# EAGLE design labwiz-module_pH-0.2 (EAGLE 6.5.0)

## Sheet 1 of 2
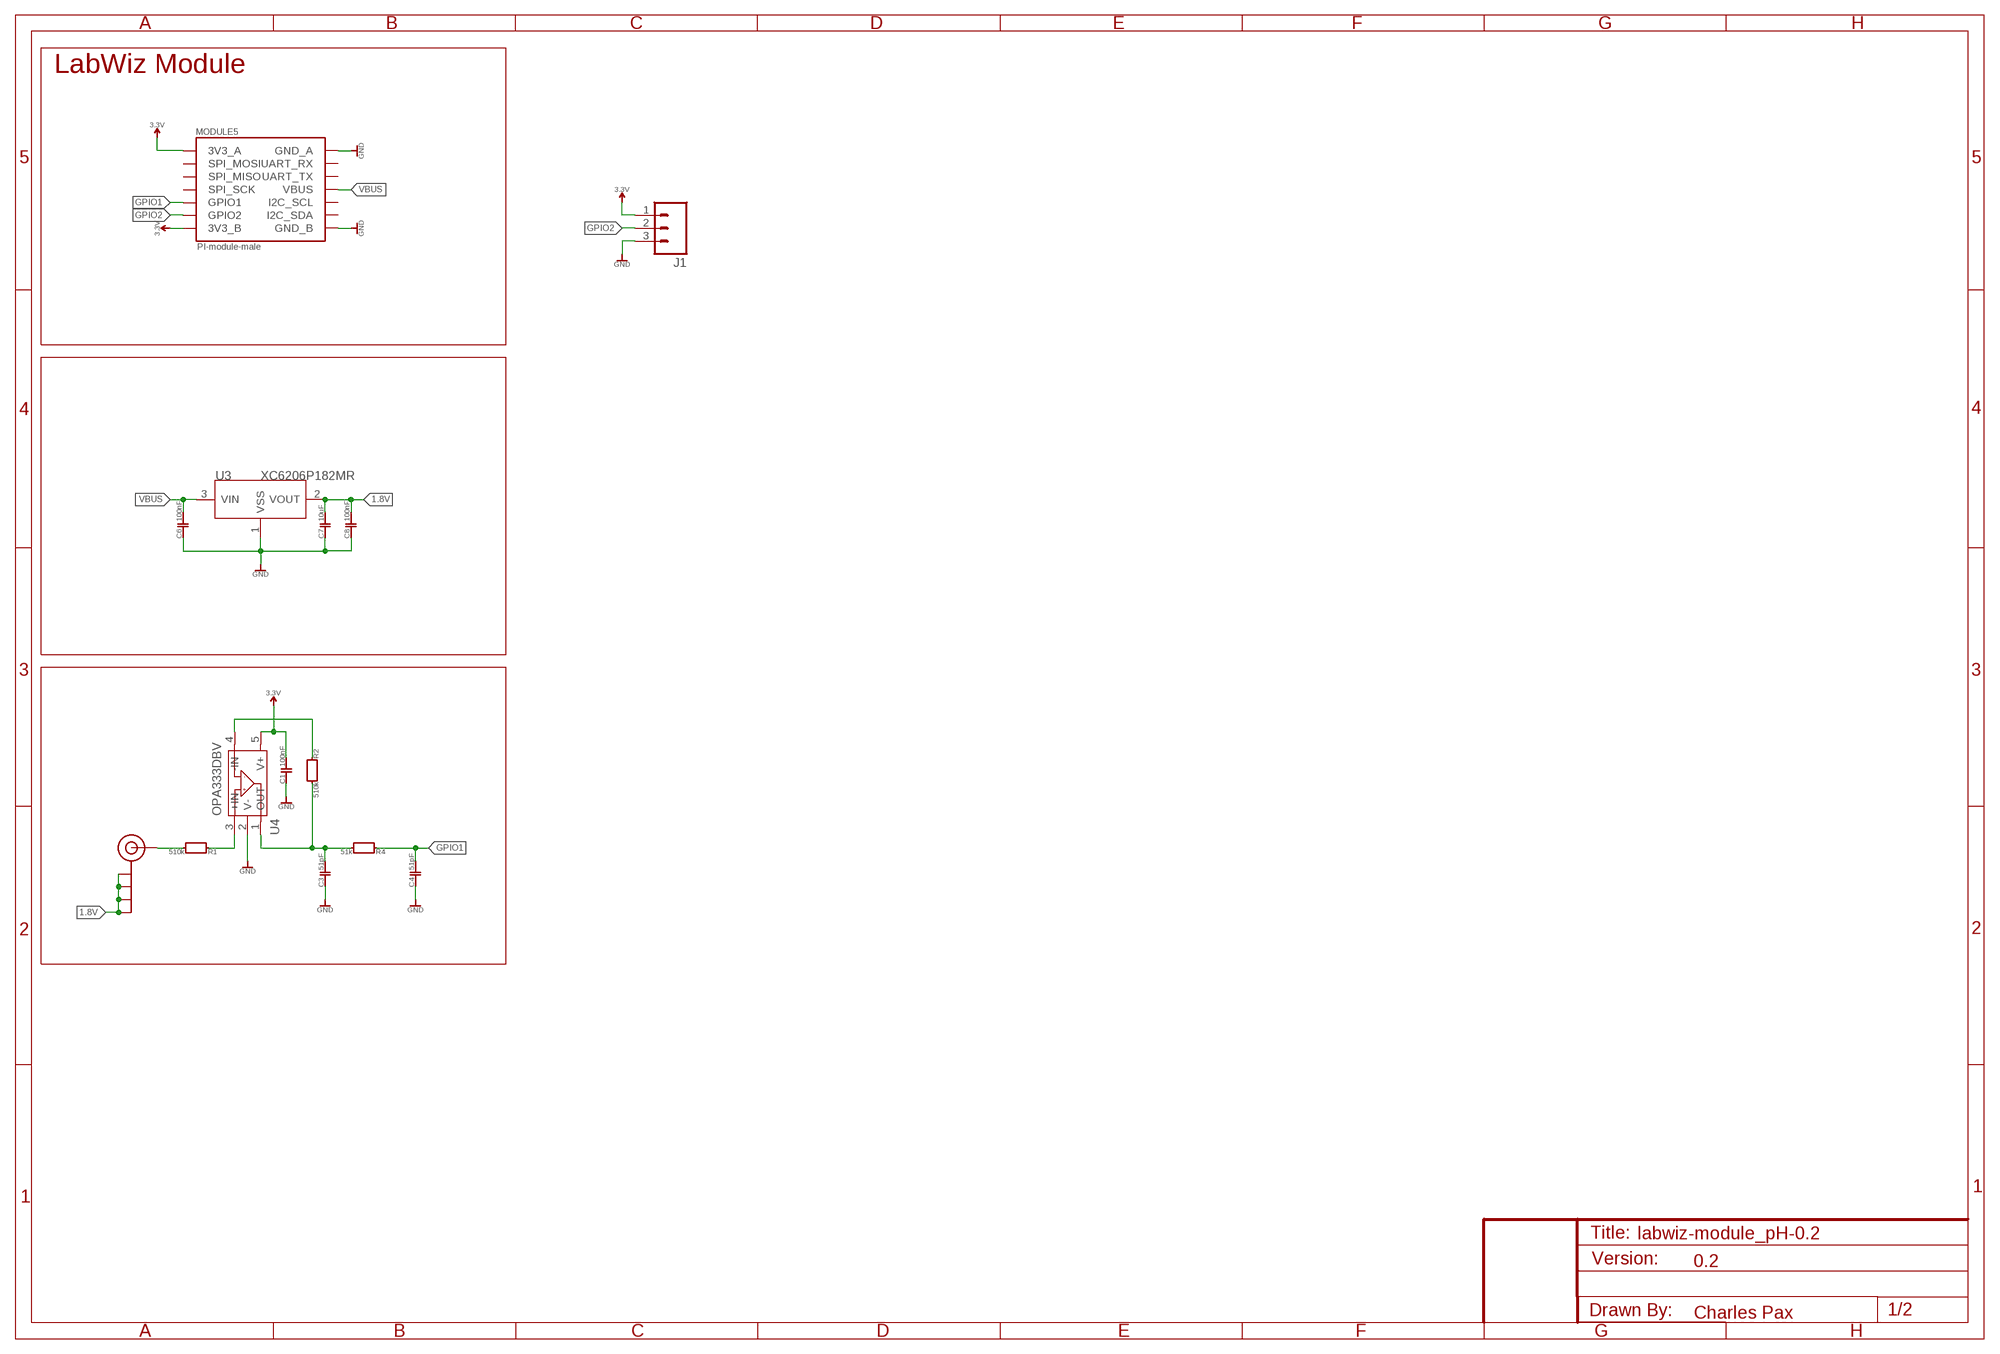
[diagram p0: schematic, sheet 1]

### Parts
C1  100nF  CAPACITOR_FIXED_100NF_0603  [0603]
C3  51pF  CAPACITOR_FIXED_0603  [0603]
C4  51pF  CAPACITOR_FIXED_0603  [0603]
C6  100nF  CAPACITOR_FIXED_100NF_0603  [0603]
C7  10uF  CAPACITOR_FIXED_10UF_0603  [0603]
C8  100nF  CAPACITOR_FIXED_100NF_0603  [0603]
J1  M03LOCK_LONGPADS  [1X03_LOCK_LONGPADS]
J$1  SMA_EDGE  [SMA-EDGE]
MODULE5  PI-module-male  PAX_MODULE_EDGE_MALE_MODULE  [M07X2_2MM_EDGE]
R1  510k  RESISTOR_FIXED_0603  [0603]
R2  510k  RESISTOR_FIXED_0603  [0603]
R4  51k  RESISTOR_FIXED_0603  [0603]
U3  XC6206P182MR  XC6206MR  [SOT23]
U4  OPA333DBV  [SOT23-5]

### Nets
1.8V: C7.2 C8.2 J$1.GND@0(GND) J$1.GND@1(GND) J$1.GND@2(GND) J$1.GND@3(GND) U3.2(VOUT)
3.3V: C1.2 J1.1 MODULE5.P$1(3V3_B) MODULE5.P$13(3V3_A) U4.5(V+)
GND: C1.1 C3.1 C4.1 C6.1 C7.1 C8.1 J1.3 MODULE5.P$2(GND_B) MODULE5.P$14(GND_A) U3.1(VSS) U4.2(V-)
GPIO1: C4.2 MODULE5.P$5(GPIO1) R4.2
GPIO2: J1.2 MODULE5.P$3(GPIO2)
N$4: J$1.SIG(SIGNAL) R1.1
N$12: R1.2 U4.3(+IN)
N$26: R2.2 U4.4(-IN)
N$37: C3.2 R2.1 R4.1 U4.1(OUT)
VBUS: C6.2 MODULE5.P$8(VBUS) U3.3(VIN)
Unconnected: MODULE5.P$4(I2C_SDA) MODULE5.P$6(I2C_SCL) MODULE5.P$7(SPI_SCK) MODULE5.P$9(SPI_MISO) MODULE5.P$10(UART_TX) MODULE5.P$11(SPI_MOSI) MODULE5.P$12(UART_RX)

### Notes on the sheet
- LabWiz Module
- 0.2
- Charles Pax

## Sheet 2 of 2

## Library data of the parts
C1 C3 C4 C6-C8 = PaxInstruments-RCL:CAPACITOR_FIXED: Capacitor
J1 = SparkFun-Connectors:M03: Header 3 Standard 3-pin 0.1" header. Use with straight break away headers (SKU : PRT-00116), right angle break away headers (PRT-00553), swiss pins (PRT-00743), machine pins (PRT-00117), and female headers (PRT-00115). Molex polarized connector foot print use with SKU : PRT-08232 with associated crimp pins and housings.
J$1 = SparkFun-Connectors:SMA_EDGE: SMA Antenna Connector End launch SMA connector. The paste layer has been removed so that the connector can be hand soldered onto the board after reflow.
MODULE5 = PaxInstruments-Connectors:PAX_MODULE; MF: Pax Instruments; MPN: PIxxxx
R1 R2 R4 = PaxInstruments-RCL:RESISTOR_FIXED: Resistor
U3 = IC:XC6206: LOW ESR Cap.Compatible Positive Voltage Regulators
U4 = IC:OPA333: 1.8V,Micro power CMOS oprational amplifiers Zero-Drift Series http://www.ti.com.cn/cn/lit/ds/symlink/opa333.pdf

## Net classes
0 Digital signal: width 0.1 mm, drill 0.2 mm, clearance 0.15 mm
1 3.3V power: width 0.1 mm, drill 0.2 mm, clearance 0.15 mm
2 RTC battery: width 0.1 mm, drill 0.2 mm, clearance 0.15 mm
3 5V power: width 0.1 mm, drill 0.2 mm, clearance 0.15 mm
4 Analog signal: width 0.1 mm, drill 0.2 mm, clearance 0.15 mm
5 GND: width 0.1 mm, drill 0.2 mm, clearance 0.15 mm

## Board
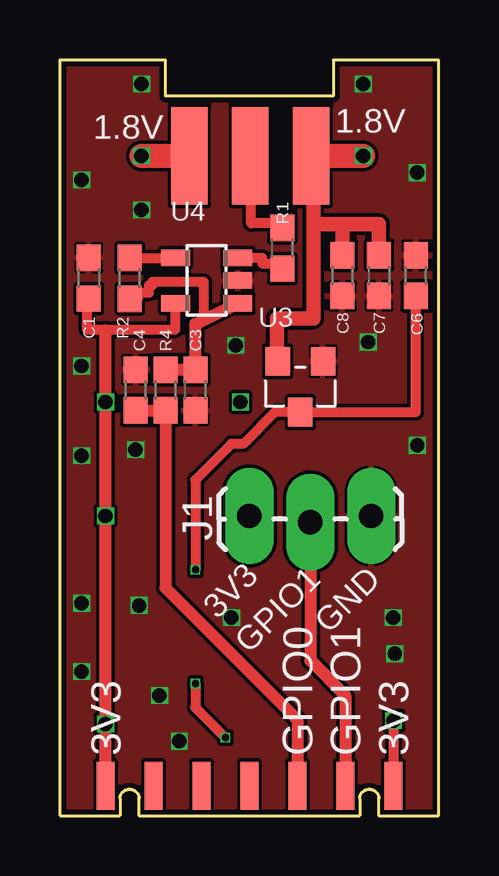
[diagram p1: board, top side]
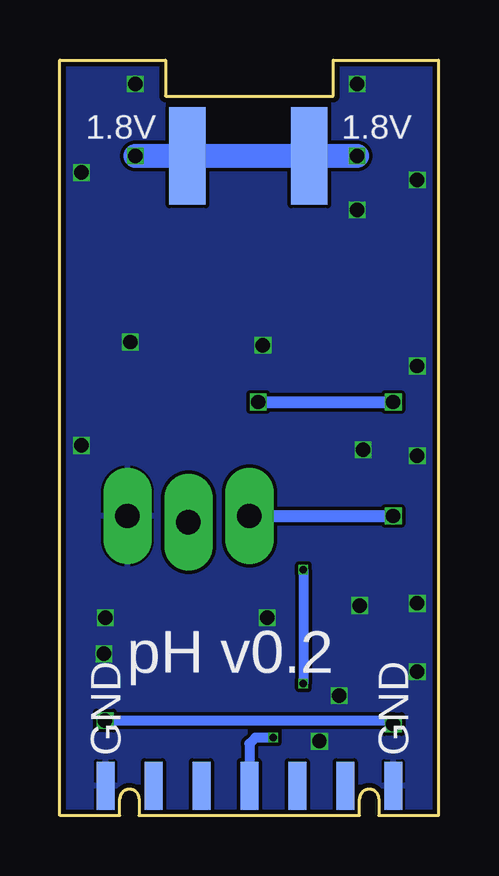
[diagram p2: board, bottom side, seen from below]

Size 15.8 x 31.5 mm. Coordinates in mm from the lower left corner, seen from the top.
Outline: 0,0 0,31.5 4.4,31.5 4.4,30 11.4,30 11.4,31.5 15.8,31.5 15.8,0 13.3,0 13.3,0.7 arc180 12.5,0.7 12.5,0 3.3,0 3.3,0.7 arc180 2.5,0.7 2.5,0 0,0
Copper layers (1*2+15*16): Top 0.017mm / dielectric 0.5mm / GND 0.017mm / dielectric 0.075mm / 3.3V 0.017mm / dielectric 0.5mm / Bottom 0.017mm
Design rules "PaxInstrument-T400 *": minimum track width 0.1mm, minimum drill 0.2mm, track to track 0.075mm, track to pad 0.075mm, pad to pad 0.075mm, via to via 0.075mm, smd to smd 0.075mm, copper to edge 0.2mm, drill to drill 0.2mm, minimum pad ring 0.5mm, minimum via ring 0.05mm, stop-mask expansion 0.01mm, vias tented up to drill 0.25mm, thermal gap 0.1mm

### Footprints (pad centres in the part's own frame; a part is rotated, then mirrored left to right if it is on the bottom)
0603 = smd 1.1 x 1: 1 -0.85,0; 2 0.85,0
1X03_LOCK_LONGPADS = drill 1.016 long: 1 0,0; 2 2.54,-0.254; 3 5.08,0
SMA-EDGE = smd 1.524 x 4.064: GND@0 0,0; GND@1 5.08,0; SIG 2.54,0 | smd 1.524 x 4.064 bottom: GND@2 0,0; GND@3 5.08,0
M07X2_2MM_EDGE = smd 0.75 x 2: P$1 0,-0.25; P$3 2,-0.25; P$5 4,-0.25; P$7 6,-0.25; P$9 8,-0.25; P$11 10,-0.25; P$13 12,-0.25 | smd 0.75 x 2 bottom: P$2 0,-0.25; P$4 2,-0.25; P$6 4,-0.25; P$8 6,-0.25; P$10 8,-0.25; P$12 10,-0.25; P$14 12,-0.25
SOT23 = smd 1.016 x 1.2: 1 -0.95,-1.06; 2 0.95,-1.06; 3 0,1.06
SOT23-5 = smd 0.69 x 1.2: 1 -0.95,-1.3; 2 0,-1.3; 3 0.95,-1.3; 4 0.95,1.3; 5 -0.95,1.3

### Placement (x,y rotation side)
C1  1.2,22.4 270 top
C3  5.65,17.74 90 top
C4  3.15,17.74 270 top
C6  14.84,22.51 270 top
C7  13.31,22.51 90 top
C8  11.79,22.51 90 top
J1  7.9,12.49 0 top
J$1  5.4,27.5 0 top
MODULE5  13.9,1 180 top
R1  9.27,23.65 270 top
R2  2.91,22.4 90 top
R4  4.4,17.74 270 top
U3  10.03,17.88 180 top
U4  6.12,22.3 90 top

### Tracks (layer width: path | path; a pad name or v marks a point on that pad's centre or on a via)
1.8V  (via drill 0.6)
  Top 0.61: U3.2 9.04,18.94 9.04,20.73 10.57,20.73 10.57,24.65 | 10.57,24.65 10.57,26.17 10.48,26.17 J$1.GND@1 | C7.2 13.31,24.65 11.79,24.65 | 11.79,24.65 10.57,24.65 | C8.2 11.79,24.65
  Top 1: J$1.GND@0 v3.4,27.5 | v12.65,27.5 J$1.GND@1
  Bottom 1: v3.4,27.5 J$1.GND@0 J$1.GND@1 v12.65,27.5
3.3V  (via drill 0.6)
  Top 0.406: MODULE5.P$1 13.92,1.25 v13.92,3.96 | C1.2 1.12,21.55 1.12,20.27 1.88,20.27 | 1.88,20.27 1.9,20.27 | 1.9,20.27 1.9,20.09 1.88,20.09 1.88,20.27 | 1.9,20.27 4.82,20.27 U4.5
  Top 0.5: MODULE5.P$13 v1.9,3.81 v1.9,12.49 v1.9,17.24 1.9,20.09
  Bottom 0.406: v13.92,3.96 1.9,3.96 v1.9,3.81
  Bottom 0.5: v7.53,17.24 v1.9,17.24 | J1.1 v1.9,12.49
GND  (via drill 0.6)
  other vias: 0.9,6 0.9,8.85 0.9,15 0.9,18.74 13.9,8.25 14.91,15.43 7.15,8.25 13.97,6.74 4.15,5 0.9,26.5 14.9,26.8 12.86,19.74 3.15,15.25 3.4,25.25 3.4,30.5 12.65,30.5 7.33,19.6 3.3,8.76 4.98,3.1
  pour Bottom: -0.1,31.5 -0.1,0 15.9,0 15.9,31.5
  pour Top: 15.9,31.5 15.9,0 -0.1,0 -0.1,31.5
GPIO1
  Top 0.5: MODULE5.P$5 9.9,4 4.4,9.5 R4.2 C4.2
GPIO2
  Top 0.5: J1.2 10.44,6.46 11.9,5 MODULE5.P$3
N$4
  Top 0.406: R1.1 9.2,24.5 9.2,24.69 7.98,24.69 7.98,26.48 7.94,26.48 J$1.SIG
N$12
  Top 0.406: U4.3 8.43,23.25 8.43,23.01 9.27,23.01 R1.2
N$26
  Top 0.406: R2.2 U4.4
N$37
  Top 0.406: R2.1 3.25,21.55 3.25,21.79 3.71,21.79 3.71,22.1 3.86,22.1 3.86,22.25 6,22.25 6,20.82 6.32,20.82
  Top 0.5: R4.1 C3.2 5.65,20.5 6.32,20.82 U4.1
VBUS  (via drill 0.3)
  Top 0.406: C6.2 14.84,16.82 U3.3 8.97,16.82 7.65,15.5 7.15,15.5 5.65,14 v5.65,10.25 | v5.65,5.5 5.65,4.5 v6.9,3.25
  Bottom 0.406: v5.65,10.25 v5.65,5.5 | v6.9,3.25 7.65,3.25 7.9,3 MODULE5.P$8

### Text on the board
tPlace: 1.8V | 1.8V | 3V3 | GPIO1 | GND | 3V3 | GPIO0 | GPIO1 | 3V3
bPlace: 1.8V | 1.8V | pH v0.2 | GND | GND